# Altium schematic sheet TOP_Sheet.SchDoc
size A4; Organization: HTL Hollabrunn; Address1: Abteilung Elektronik; Address2: Anton Ehrenfried-Straße 10; Address3: 2020 Hollabrunn
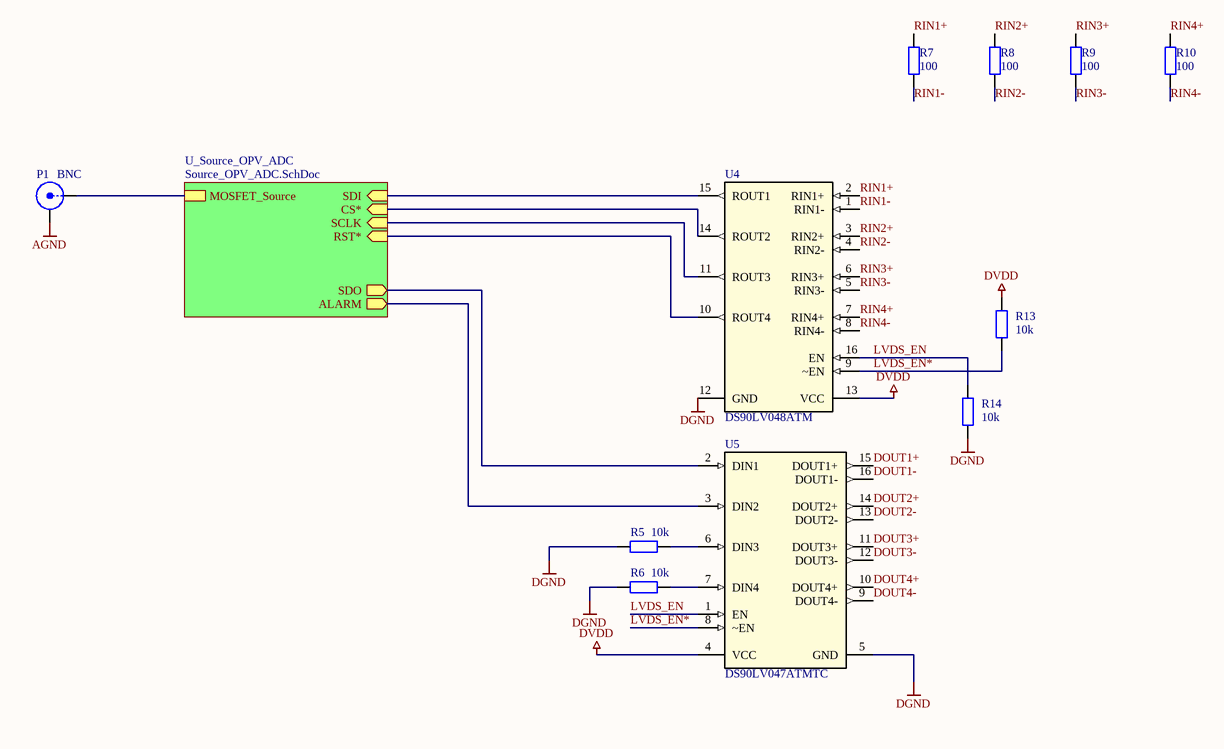
[diagram p0: TOP_Sheet.SchDoc]

## Parts
P1  BNC  [BNC_RA CON]
R5  10k  [C1206-KUE]
R6  10k  [C1206-KUE]
R7  100  [C1206-KUE]
R8  100  [C1206-KUE]
R9  100  [C1206-KUE]
R10  100  [C1206-KUE]
R13  10k  [C1206-KUE]
R14  10k  [C1206-KUE]
U4  DS90LV048ATM  [SOIC-16N]
U5  DS90LV047ATMTC  [SOIC-16N]

## Sub-sheets
U_Source_OPV_ADC = Source_OPV_ADC.SchDoc: MOSFET_Source, SDI (in), CS* (in), SCLK (in), SDO (out), ALARM (out), RST* (in)

## Nets
AGND: P1.2(Y)
DGND: R5.2 R6.2 R14.1 U4.12(GND) U5.5(GND)
DVDD: R13.2 U4.13(VCC) U5.4(VCC)
DOUT1+: U5.15(DOUT1+)
DOUT1-: U5.16(DOUT1-)
DOUT2+: U5.14(DOUT2+)
DOUT2-: U5.13(DOUT2-)
DOUT3+: U5.11(DOUT3+)
DOUT3-: U5.12(DOUT3-)
DOUT4+: U5.10(DOUT4+)
DOUT4-: U5.9(DOUT4-)
LVDS_EN: R14.2 U4.16(EN) U5.1(EN)
LVDS_EN*: R13.1 U4.9(~EN) U5.8(~EN)
RIN1+: R7.1 U4.2(RIN1+)
RIN1-: R7.2 U4.1(RIN1-)
RIN2+: R8.1 U4.3(RIN2+)
RIN2-: R8.2 U4.4(RIN2-)
RIN3+: R9.1 U4.6(RIN3+)
RIN3-: R9.2 U4.5(RIN3-)
RIN4+: R10.1 U4.7(RIN4+)
RIN4-: R10.2 U4.8(RIN4-)
NetP1_1: P1.1(X) ; sheet U_Source_OPV_ADC/MOSFET_Source
NetR5_1: R5.1 U5.6(DIN3)
NetR6_1: R6.1 U5.7(DIN4)
NetU4_10: U4.10(ROUT4) ; sheet U_Source_OPV_ADC/RST*
NetU4_11: U4.11(ROUT3) ; sheet U_Source_OPV_ADC/SCLK
NetU4_14: U4.14(ROUT2) ; sheet U_Source_OPV_ADC/CS*
NetU4_15: U4.15(ROUT1) ; sheet U_Source_OPV_ADC/SDI
NetU5_2: U5.2(DIN1) ; sheet U_Source_OPV_ADC/SDO
NetU5_3: U5.3(DIN2) ; sheet U_Source_OPV_ADC/ALARM

## Notes on the sheet
- Title
- Size:
- Date:
- A4
- Number:
- Time:
- Revision:
- Sheet
- of
- HTL Hollabrunn
- Abteilung Elektronik
- Anton Ehrenfried-Straße 10
- 2020 Hollabrunn
- File:
- Drawn By:

## Library data of the parts
P1 = BNC: BNC Elbow Connector; LatestRevisionDate: 17-Jul-2002; LatestRevisionNote: Re-released for DXP Platform.; Publisher: Altium Limited
R5-R10 R13 R14 = ResistorSMD: Resistor SMD; Manufacturer: AVX; Bezeichnung: SMD Wid. 1/8W 2%; Published: 8-Jun-2000; LatestRevisionDate: 17-Jul-2002; LatestRevisionNote: Re-released for DXP Platform.; PackageReference: AXIAL-0.4; Publisher: Altium Limited; PackageDescription: Axial Device, Thru-Hole; 2 Leads; 0.4 in Pin Spacing; Orderingcode: *
  R5 R6 R13 R14: Value: 10k
  R7-R10: Value: 100
U4 = DS90LV048ATM: 400-Mbps LVDS quad high-speed differential receiver 16-SOIC -40 to 85; Manufacturer_Name: Texas Instruments; Manufacturer: NationalSemiconductor; PackageTopMarking: NS2ZXYTTE#DS90LV048ATM; PowerWise: N; CompType: InterfaceIC; ComponentLink1DescBC: DS90LV048ADatasheet; ComponentLink2DescA4: DS90LV048AWebPage; ComponentLink3DescAC: M16APackagePage; Copyright: Copyright (C) 2026 Ultra Librarian. All rights reserved.; Manufacturer_Part_Number: DS90LV048ATM; Datasheet: https://www.ti.com/lit/gpn/ds90lv048a; Published: 4-Dec-2008; DatasheetVersion: May-2001; PackageVersion: revJAug-1995; PackageReference: M16A; Publisher: AltiumLimited; PackageDescription: MoldedPackageSO150inWide16Lead; Supplier: 1Farnell; SUPPLIER_2: PartNumb0C9485856; PartNumber: DS90LV048ATM; RoHS: N; PinCount: 16; Code_JEDEC: MS-012-AC; Code_IPC: SOIC127P600-16; ComponentLink1URL: http//wwwnationalcom/ds/DS/DS90LV048Apdf; ComponentLink2URL: http//wwwnationalcom/pf/DS/DS90LV048Ahtml; ComponentLink3URL: http//wwwnationalcom/packaging/folders/m16ahtml
U5 = DS90LV047ATMTC: 400-Mbps LVDS quad high-speed differential driver 16-TSSOP -40 to 85; Manufacturer_Name: Texas Instruments; Manufacturer: NationalSemiconductor; PackageTopMarking: NS2ZXYTTDS90LV047AT; PowerWise: N; CompType: InterfaceIC; ComponentLink1DescBC: DS90LV047ADatasheet; ComponentLink2DescA4: DS90LV047AWebPage; ComponentLink3DescAC: MTC16PackagePage; Copyright: Copyright (C) 2025 Ultra Librarian. All rights reserved.; Manufacturer_Part_Number: DS90LV047ATMTC; Published: 4-Dec-2008; DatasheetVersion: Jan-2003; PackageVersion: revDJun-2003; PackageReference: MTC16; Publisher: AltiumLimited; PackageDescription: MoldedTSSOPJedec5x44x09mmBody16Lead065mmPitch; Supplier: 1Farnell; SUPPLIER_2: PartNumb0C9778659; PartNumber: DS90LV047ATMTC; RoHS: N; PinCount: 16; Code_JEDEC: MO-153-AB; ComponentLink1URL: http//wwwnationalcom/ds/DS/DS90LV047Apdf; ComponentLink2URL: http//wwwnationalcom/pf/DS/DS90LV047Ahtml; ComponentLink3URL: http//wwwnationalcom/packaging/folders/mtc16html